# Altium project Roomba.PrjPcb
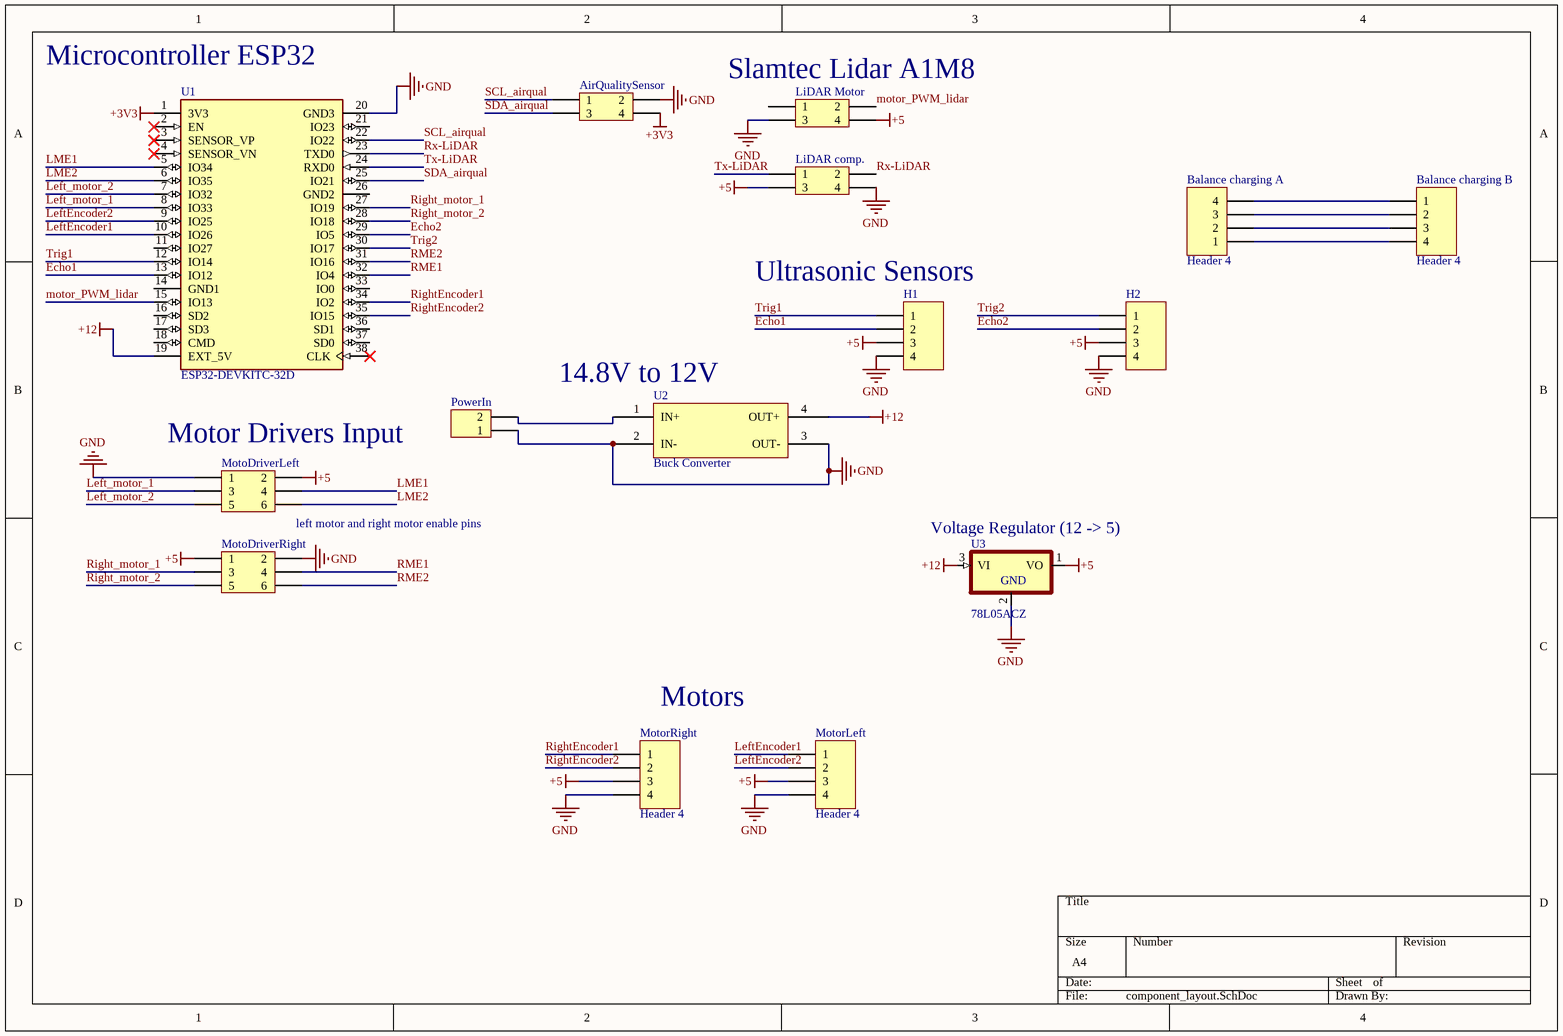
[diagram p0: component_layout.SchDoc]
1 sheet, 15 parts. Net scope: global (net labels, ports and power ports of the same name join across sheets).
Board file: PCB2.PcbDoc

## Sheet component_layout.SchDoc
size A4; SheetNumber: 1; SheetTotal: 1

### Parts
AirQualitySensor  HEADER  [HDR2X2]  (value not drawn)
Balance_charging_A  Header 4  [HDR1X4]
Balance_charging_B  Header 4  [HDR1X4]
H1  Header 4  [HDR1X4]  (value not drawn)
H2  Header 4  [HDR1X4]  (value not drawn)
LiDAR_comp.  HEADER  [HDR2X2]  (value not drawn)
LiDAR_Motor  HEADER  [HDR2X2]  (value not drawn)
MotoDriverLeft  HEADER  [HDR2X3]  (value not drawn)
MotoDriverRight  HEADER  [HDR2X3]  (value not drawn)
MotorLeft  Header 4  [HDR1X4]
MotorRight  Header 4  [HDR1X4]
PowerIn  Header 2  [HDR1X2]  (value not drawn)
U1  ESP32-DEVKITC-32D  [MODULE_ESP32-DEVKITC-32D]
U2  Buck Converter  [Buck Converter]
U3  78L05ACZ  [TO-92]

### Nets
+3V3: AirQualitySensor.4 U1.1(3V3)
+5: H1.3 H2.3 LiDAR_comp..3 LiDAR_Motor.4 MotoDriverLeft.2 MotoDriverRight.1 MotorLeft.3 MotorRight.3 U3.1(VO)
+12: U1.19(EXT_5V) U2.4(OUT+) U3.3(VI)
GND: AirQualitySensor.2 H1.4 H2.4 LiDAR_comp..4 LiDAR_Motor.3 MotoDriverLeft.1 MotoDriverRight.2 MotorLeft.4 MotorRight.4 PowerIn.1 U1.20(GND3) U2.2(IN-) U2.3(OUT-) U3.2(GND)
Echo1: H1.2 U1.13(IO12)
Echo2: H2.2 U1.29(IO5)
Left_motor_1: MotoDriverLeft.3 U1.8(IO33)
Left_motor_2: MotoDriverLeft.5 U1.7(IO32)
LeftEncoder1: MotorLeft.1 U1.10(IO26)
LeftEncoder2: MotorLeft.2 U1.9(IO25)
LME1: MotoDriverLeft.4 U1.5(IO34)
LME2: MotoDriverLeft.6 U1.6(IO35)
motor_PWM_lidar: LiDAR_Motor.2 U1.15(IO13)
Right_motor_1: MotoDriverRight.3 U1.27(IO19)
Right_motor_2: MotoDriverRight.5 U1.28(IO18)
RightEncoder1: MotorRight.1 U1.34(IO2)
RightEncoder2: MotorRight.2 U1.35(IO15)
RME1: MotoDriverRight.4 U1.32(IO4)
RME2: MotoDriverRight.6 U1.31(IO16)
Rx-LiDAR: LiDAR_comp..2 U1.23(TXD0)
SCL_airqual: AirQualitySensor.1 U1.22(IO22)
SDA_airqual: AirQualitySensor.3 U1.25(IO21)
Trig1: H1.1 U1.12(IO14)
Trig2: H2.1 U1.30(IO17)
Tx-LiDAR: LiDAR_comp..1 U1.24(RXD0)
NetBalance_charging_A_1: Balance_charging_A.1 Balance_charging_B.4
NetBalance_charging_A_2: Balance_charging_A.2 Balance_charging_B.3
NetBalance_charging_A_3: Balance_charging_A.3 Balance_charging_B.2
NetBalance_charging_A_4: Balance_charging_A.4 Balance_charging_B.1
NetPowerIn_2: PowerIn.2 U2.1(IN+)

Not connected (* = marked no-connect by the designer): LiDAR_Motor 1; U1 2(EN)* 3(SENSOR_VP)* 4(SENSOR_VN)* 11(IO27) 14(GND1) 16(SD2) 17(SD3) 18(CMD) 21(IO23) 26(GND2) 33(IO0) 36(SD1) 37(SD0) 38(CLK)*

### Notes on the sheet
- (near U1) Microcontroller ESP32
- (near LiDAR_Motor) Slamtec Lidar A1M8
- (near H1) Ultrasonic Sensors
- (near U2) 14.8V to 12V
- (near MotoDriverLeft) Motor Drivers Input
- left motor and right motor enable pins
- (near U3) Voltage Regulator (12 -> 5)
- (near MotorRight) Motors

### Library data of the parts
AirQualitySensor LiDAR_comp. LiDAR_Motor = Header 2x2: Header, 5-Pin, Dual row; Revision: 17-Jul-2002: Re-released for DXP Platform.; Publisher: Altium Limited
Balance_charging_A Balance_charging_B MotorLeft MotorRight = Header 4: Header, 4-Pin; LatestRevisionDate: 17-Jul-2002; LatestRevisionNote: Re-released for DXP Platform.; Publisher: Altium Limited
H1 H2 = Header 4: Header, 4-Pin; Manufacturer: Generic Components; Class: Connector
MotoDriverLeft MotoDriverRight = Header 2x3: Header, 5-Pin, Dual row; Revision: 17-Jul-2002: Re-released for DXP Platform.; Publisher: Altium Limited
PowerIn = Header 2: Header, 2-Pin; Manufacturer: Generic Components; Class: Connector
U1 = ESP32-DEVKITC-32D: WiFi Development Tools (802.11) ESP32 General Development Kit, ESP32-WROOM-32D on the board; MF: Espressif Systems; Price: None; Availability: In Stock; MP: ESP32-DEVKITC-32D; Package: None; SnapEDA_Link: https://www.snapeda.com/parts/ESP32-DEVKITC-32D/Espressif+Systems/view-part/?ref=snap; Check_prices: https://www.snapeda.com/parts/ESP32-DEVKITC-32D/Espressif+Systems/view-part/?ref=eda; Value: *; Purchase-URL: https://pricing.snapeda.com/search/part/ESP32-DEVKITC-32D/?ref=eda
U2 = Buck Converter: Buck Convertor
U3 = 78L05ACZ: Linear Voltage Regulator IC Positive Fixed 1 Output 100mA TO-92-3; MF: STMicroelectronics; SnapEDA_Link: https://www.snapeda.com/parts/78L05ACZ/STMicroelectronics/view-part/?ref=snap; Package: TO-92 ON; MP: 78L05ACZ; Check_prices: https://www.snapeda.com/parts/78L05ACZ/STMicroelectronics/view-part/?ref=eda; Purchase-URL: https://pricing.snapeda.com/search/part/78L05ACZ/?ref=eda; Price: None; Value: *; Availability: In Stock